# Altium schematic sheet Sheet2.SchDoc
size A3
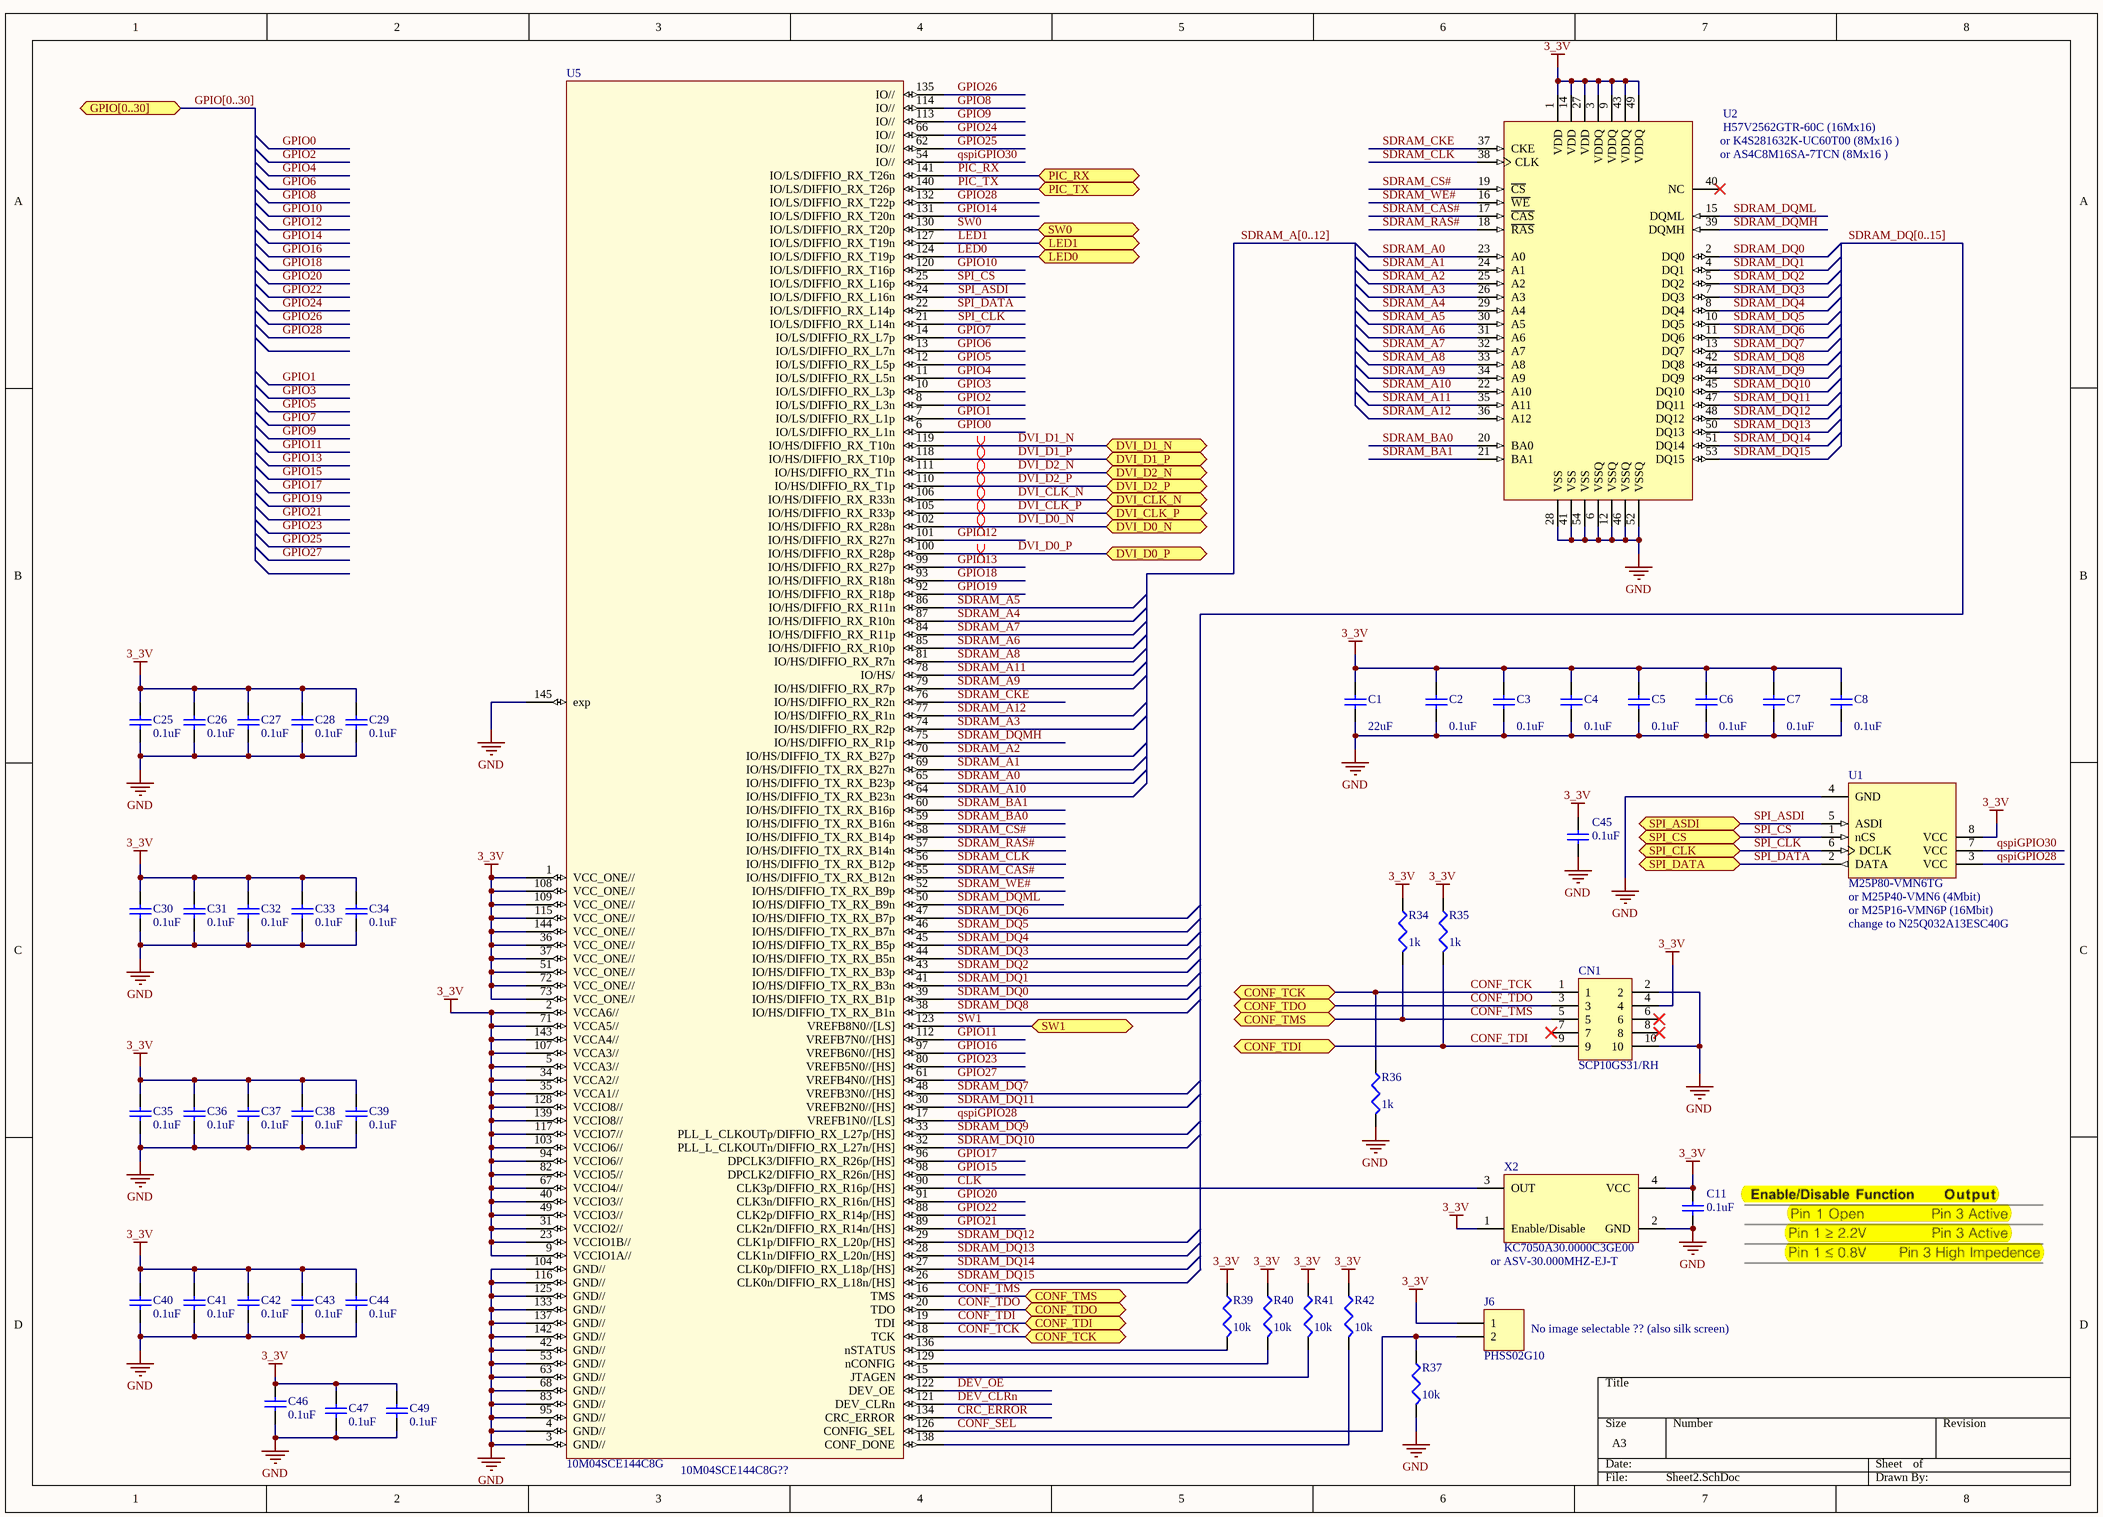
[diagram p0: Sheet2.SchDoc]

## Parts
C1  value 22uF  [CHIP3216]  (hidden comment: MC1206F226Z100CT)
C2  value 0.1uF  [CHIP1608]  (hidden comment: MC0603B104M160CT)
C3  value 0.1uF  [CHIP1608]  (hidden comment: MC0603B104M160CT)
C4  value 0.1uF  [CHIP1608]  (hidden comment: MC0603B104M160CT)
C5  value 0.1uF  [CHIP1608]  (hidden comment: MC0603B104M160CT)
C6  value 0.1uF  [CHIP1608]  (hidden comment: MC0603B104M160CT)
C7  value 0.1uF  [CHIP1608]  (hidden comment: MC0603B104M160CT)
C8  value 0.1uF  [CHIP1608]  (hidden comment: MC0603B104M160CT)
C11  value 0.1uF  [CHIP1608]  (hidden comment: MC0603B104M160CT)
C25  value 0.1uF  [CHIP1608]  (hidden comment: MC0603B104M160CT)
C26  value 0.1uF  [CHIP1608]  (hidden comment: MC0603B104M160CT)
C27  value 0.1uF  [CHIP1608]  (hidden comment: MC0603B104M160CT)
C28  value 0.1uF  [CHIP1608]  (hidden comment: MC0603B104M160CT)
C29  value 0.1uF  [CHIP1608]  (hidden comment: MC0603B104M160CT)
C30  value 0.1uF  [CHIP1608]  (hidden comment: MC0603B104M160CT)
C31  value 0.1uF  [CHIP1608]  (hidden comment: MC0603B104M160CT)
C32  value 0.1uF  [CHIP1608]  (hidden comment: MC0603B104M160CT)
C33  value 0.1uF  [CHIP1608]  (hidden comment: MC0603B104M160CT)
C34  value 0.1uF  [CHIP1608]  (hidden comment: MC0603B104M160CT)
C35  value 0.1uF  [CHIP1608]  (hidden comment: MC0603B104M160CT)
C36  value 0.1uF  [CHIP1608]  (hidden comment: MC0603B104M160CT)
C37  value 0.1uF  [CHIP1608]  (hidden comment: MC0603B104M160CT)
C38  value 0.1uF  [CHIP1608]  (hidden comment: MC0603B104M160CT)
C39  value 0.1uF  [CHIP1608]  (hidden comment: MC0603B104M160CT)
C40  value 0.1uF  [CHIP1608]  (hidden comment: MC0603B104M160CT)
C41  value 0.1uF  [CHIP1608]  (hidden comment: MC0603B104M160CT)
C42  value 0.1uF  [CHIP1608]  (hidden comment: MC0603B104M160CT)
C43  value 0.1uF  [CHIP1608]  (hidden comment: MC0603B104M160CT)
C44  value 0.1uF  [CHIP1608]  (hidden comment: MC0603B104M160CT)
C45  value 0.1uF  [CHIP1608]  (hidden comment: MC0603B104M160CT)
C46  value 0.1uF  [CHIP1608]  (hidden comment: MC0603B104M160CT)
C47  value 0.1uF  [CHIP1608]  (hidden comment: MC0603B104M160CT)
C49  value 0.1uF  [CHIP1608]  (hidden comment: MC0603B104M160CT)
CN1  SCP10GS31/RH  [SCP10GS31/RH]
J6  PHSS02G10  [HDR1X2]
R34  value 1k  [CHIP1608]  (hidden comment: MCMR06X1001FTL)
R35  value 1k  [CHIP1608]  (hidden comment: MCMR06X1001FTL)
R36  value 1k  [CHIP1608]  (hidden comment: MCMR06X1001FTL)
R37  value 10k  [CHIP1608]  (hidden comment: MCWR06X1002FTL)
R39  value 10k  [CHIP1608]  (hidden comment: MCWR06X1002FTL)
R40  value 10k  [CHIP1608]  (hidden comment: MCWR06X1002FTL)
R41  value 10k  [CHIP1608]  (hidden comment: MCWR06X1002FTL)
R42  value 10k  [CHIP1608]  (hidden comment: MCWR06X1002FTL)
U1  M25P80-VMN6TG  [SOIC8_L]
U2  H57V2562GTR-60C (16Mx16)  [TSOP2-54_M]
U5  10M04SCE144C8G  [TEST2]
X2  KC7050A30.0000C3GE00  [CWX823-50.0M]

## Ports
CONF_TCK, CONF_TDI, CONF_TDO, CONF_TMS, DVI_CLK_N, DVI_CLK_P, DVI_D0_N, DVI_D0_P, DVI_D1_N, DVI_D1_P, DVI_D2_N, DVI_D2_P, GPIO[0..30], LED0, LED1, PIC_RX, PIC_TX, SPI_ASDI, SPI_CLK, SPI_CS, SPI_DATA, SW0, SW1

## Nets
3_3V: C1.2 C2.2 C3.2 C4.2 C5.2 C6.2 C7.2 C8.2 C11.2 C25.1 C26.1 C27.1 C28.1 C29.1 C30.1 C31.1 C32.1 C33.1 C34.1 C35.1 C36.1 C37.1 C38.1 C39.1 C40.1 C41.1 C42.1 C43.1 C44.1 C45.2 C46.1 C47.1 C49.1 CN1.4 J6.1 R34.1 R35.1 R39.1 R40.1 R41.1 R42.1 U1.8(VCC) U2.1(VDD) U2.3(VDDQ) U2.9(VDDQ) U2.14(VDD) U2.27(VDD) U2.43(VDDQ) U2.49(VDDQ) U5.1(VCC_ONE//) U5.2(VCCA6//) U5.5(VCCA3//) U5.9(VCCIO1A//) U5.23(VCCIO1B//) U5.31(VCCIO2//) U5.34(VCCA2//) U5.35(VCCA1//) U5.36(VCC_ONE//) U5.37(VCC_ONE//) U5.40(VCCIO3//) U5.49(VCCIO3//) U5.51(VCC_ONE//) U5.67(VCCIO4//) U5.71(VCCA5//) U5.72(VCC_ONE//) U5.73(VCC_ONE//) U5.82(VCCIO5//) U5.94(VCCIO6//) U5.103(VCCIO6//) U5.107(VCCA3//) U5.108(VCC_ONE//) U5.109(VCC_ONE//) U5.115(VCC_ONE//) U5.117(VCCIO7//) U5.128(VCCIO8//) U5.139(VCCIO8//) U5.143(VCCA4//) U5.144(VCC_ONE//) X2.1(Enable/Disable) X2.4(VCC)
GND: C1.1 C2.1 C3.1 C4.1 C5.1 C6.1 C7.1 C8.1 C11.1 C25.2 C26.2 C27.2 C28.2 C29.2 C30.2 C31.2 C32.2 C33.2 C34.2 C35.2 C36.2 C37.2 C38.2 C39.2 C40.2 C41.2 C42.2 C43.2 C44.2 C45.1 C46.2 C47.2 C49.2 CN1.2 CN1.10 R36.2 R37.2 U1.4(GND) U2.6(VSSQ) U2.12(VSSQ) U2.28(VSS) U2.41(VSS) U2.46(VSSQ) U2.52(VSSQ) U2.54(VSS) U5.3(GND//) U5.4(GND//) U5.42(GND//) U5.53(GND//) U5.63(GND//) U5.68(GND//) U5.83(GND//) U5.95(GND//) U5.104(GND//) U5.116(GND//) U5.125(GND//) U5.133(GND//) U5.137(GND//) U5.142(GND//) U5.145(exp) X2.2(GND)
CLK: U5.90(CLK3p/DIFFIO_RX_R16p/[HS]) X2.3(OUT)
CONF_SEL: J6.2 R37.1 U5.126(CONFIG_SEL)
CONF_TCK: CN1.1 R36.1 U5.18(TCK) ; port CONF_TCK
CONF_TDI: CN1.9 R35.2 U5.19(TDI) ; port CONF_TDI
CONF_TDO: CN1.3 U5.20(TDO) ; port CONF_TDO
CONF_TMS: CN1.5 R34.2 U5.16(TMS) ; port CONF_TMS
CRC_ERROR: U5.134(CRC_ERROR)
DEV_CLRn: U5.121(DEV_CLRn)
DEV_OE: U5.122(DEV_OE)
DVI_CLK_N: U5.106(IO/HS/DIFFIO_RX_R33n) ; port DVI_CLK_N
DVI_CLK_P: U5.105(IO/HS/DIFFIO_RX_R33p) ; port DVI_CLK_P
DVI_D0_N: U5.102(IO/HS/DIFFIO_RX_R28n) ; port DVI_D0_N
DVI_D0_P: U5.100(IO/HS/DIFFIO_RX_R28p) ; port DVI_D0_P
DVI_D1_N: U5.119(IO/HS/DIFFIO_RX_T10n) ; port DVI_D1_N
DVI_D1_P: U5.118(IO/HS/DIFFIO_RX_T10p) ; port DVI_D1_P
DVI_D2_N: U5.111(IO/HS/DIFFIO_RX_T1n) ; port DVI_D2_N
DVI_D2_P: U5.110(IO/HS/DIFFIO_RX_T1p) ; port DVI_D2_P
GPIO0: U5.6(IO/LS/DIFFIO_RX_L1n)
GPIO1: U5.7(IO/LS/DIFFIO_RX_L1p)
GPIO2: U5.8(IO/LS/DIFFIO_RX_L3n)
GPIO3: U5.10(IO/LS/DIFFIO_RX_L3p)
GPIO4: U5.11(IO/LS/DIFFIO_RX_L5n)
GPIO5: U5.12(IO/LS/DIFFIO_RX_L5p)
GPIO6: U5.13(IO/LS/DIFFIO_RX_L7n)
GPIO7: U5.14(IO/LS/DIFFIO_RX_L7p)
GPIO8: U5.114(IO//)
GPIO9: U5.113(IO//)
GPIO10: U5.120(IO/LS/DIFFIO_RX_T16p)
GPIO11: U5.112(VREFB7N0//[HS])
GPIO12: U5.101(IO/HS/DIFFIO_RX_R27n)
GPIO13: U5.99(IO/HS/DIFFIO_RX_R27p)
GPIO14: U5.131(IO/LS/DIFFIO_RX_T20n)
GPIO15: U5.98(DPCLK2/DIFFIO_RX_R26n/[HS])
GPIO16: U5.97(VREFB6N0//[HS])
GPIO17: U5.96(DPCLK3/DIFFIO_RX_R26p/[HS])
GPIO18: U5.93(IO/HS/DIFFIO_RX_R18n)
GPIO19: U5.92(IO/HS/DIFFIO_RX_R18p)
GPIO20: U5.91(CLK3n/DIFFIO_RX_R16n/[HS])
GPIO21: U5.89(CLK2n/DIFFIO_RX_R14n/[HS])
GPIO22: U5.88(CLK2p/DIFFIO_RX_R14p/[HS])
GPIO23: U5.80(VREFB5N0//[HS])
GPIO24: U5.66(IO//)
GPIO25: U5.62(IO//)
GPIO26: U5.135(IO//)
GPIO27: U5.61(VREFB4N0//[HS])
GPIO28: U5.132(IO/LS/DIFFIO_RX_T22p)
LED0: U5.124(IO/LS/DIFFIO_RX_T19p) ; port LED0
LED1: U5.127(IO/LS/DIFFIO_RX_T19n) ; port LED1
PIC_RX: U5.141(IO/LS/DIFFIO_RX_T26n) ; port PIC_RX
PIC_TX: U5.140(IO/LS/DIFFIO_RX_T26p) ; port PIC_TX
qspiGPIO28: U1.3(VCC) U5.17(VREFB1N0//[LS])
qspiGPIO30: U1.7(VCC) U5.54(IO//)
SDRAM_A0: U2.23(A0) U5.65(IO/HS/DIFFIO_TX_RX_B23p)
SDRAM_A1: U2.24(A1) U5.69(IO/HS/DIFFIO_TX_RX_B27n)
SDRAM_A2: U2.25(A2) U5.70(IO/HS/DIFFIO_TX_RX_B27p)
SDRAM_A3: U2.26(A3) U5.74(IO/HS/DIFFIO_RX_R2p)
SDRAM_A4: U2.29(A4) U5.87(IO/HS/DIFFIO_RX_R10n)
SDRAM_A5: U2.30(A5) U5.86(IO/HS/DIFFIO_RX_R11n)
SDRAM_A6: U2.31(A6) U5.85(IO/HS/DIFFIO_RX_R10p)
SDRAM_A7: U2.32(A7) U5.84(IO/HS/DIFFIO_RX_R11p)
SDRAM_A8: U2.33(A8) U5.81(IO/HS/DIFFIO_RX_R7n)
SDRAM_A9: U2.34(A9) U5.79(IO/HS/DIFFIO_RX_R7p)
SDRAM_A10: U2.22(A10) U5.64(IO/HS/DIFFIO_TX_RX_B23n)
SDRAM_A11: U2.35(A11) U5.78(IO/HS/)
SDRAM_A12: U2.36(A12) U5.77(IO/HS/DIFFIO_RX_R1n)
SDRAM_BA0: U2.20(BA0) U5.59(IO/HS/DIFFIO_TX_RX_B16n)
SDRAM_BA1: U2.21(BA1) U5.60(IO/HS/DIFFIO_TX_RX_B16p)
SDRAM_CAS#: U2.17(~{CAS}) U5.55(IO/HS/DIFFIO_TX_RX_B12n)
SDRAM_CKE: U2.37(CKE) U5.76(IO/HS/DIFFIO_RX_R2n)
SDRAM_CLK: U2.38(CLK) U5.56(IO/HS/DIFFIO_TX_RX_B12p)
SDRAM_CS#: U2.19(~{CS}) U5.58(IO/HS/DIFFIO_TX_RX_B14p)
SDRAM_DQ0: U2.2(DQ0) U5.39(IO/HS/DIFFIO_TX_RX_B1p)
SDRAM_DQ1: U2.4(DQ1) U5.41(IO/HS/DIFFIO_TX_RX_B3n)
SDRAM_DQ2: U2.5(DQ2) U5.43(IO/HS/DIFFIO_TX_RX_B3p)
SDRAM_DQ3: U2.7(DQ3) U5.44(IO/HS/DIFFIO_TX_RX_B5n)
SDRAM_DQ4: U2.8(DQ4) U5.45(IO/HS/DIFFIO_TX_RX_B5p)
SDRAM_DQ5: U2.10(DQ5) U5.46(IO/HS/DIFFIO_TX_RX_B7n)
SDRAM_DQ6: U2.11(DQ6) U5.47(IO/HS/DIFFIO_TX_RX_B7p)
SDRAM_DQ7: U2.13(DQ7) U5.48(VREFB3N0//[HS])
SDRAM_DQ8: U2.42(DQ8) U5.38(IO/HS/DIFFIO_TX_RX_B1n)
SDRAM_DQ9: U2.44(DQ9) U5.33(PLL_L_CLKOUTp/DIFFIO_RX_L27p/[HS])
SDRAM_DQ10: U2.45(DQ10) U5.32(PLL_L_CLKOUTn/DIFFIO_RX_L27n/[HS])
SDRAM_DQ11: U2.47(DQ11) U5.30(VREFB2N0//[HS])
SDRAM_DQ12: U2.48(DQ12) U5.29(CLK1p/DIFFIO_RX_L20p/[HS])
SDRAM_DQ13: U2.50(DQ13) U5.28(CLK1n/DIFFIO_RX_L20n/[HS])
SDRAM_DQ14: U2.51(DQ14) U5.27(CLK0p/DIFFIO_RX_L18p/[HS])
SDRAM_DQ15: U2.53(DQ15) U5.26(CLK0n/DIFFIO_RX_L18n/[HS])
SDRAM_DQMH: U2.39(DQMH) U5.75(IO/HS/DIFFIO_RX_R1p)
SDRAM_DQML: U2.15(DQML) U5.50(IO/HS/DIFFIO_TX_RX_B9n)
SDRAM_RAS#: U2.18(~{RAS}) U5.57(IO/HS/DIFFIO_TX_RX_B14n)
SDRAM_WE#: U2.16(~{WE}) U5.52(IO/HS/DIFFIO_TX_RX_B9p)
SPI_ASDI: U1.5(ASDI) U5.24(IO/LS/DIFFIO_RX_L16n) ; port SPI_ASDI
SPI_CLK: U1.6(DCLK) U5.21(IO/LS/DIFFIO_RX_L14n) ; port SPI_CLK
SPI_CS: U1.1(nCS) U5.25(IO/LS/DIFFIO_RX_L16p) ; port SPI_CS
SPI_DATA: U1.2(DATA) U5.22(IO/LS/DIFFIO_RX_L14p) ; port SPI_DATA
SW0: U5.130(IO/LS/DIFFIO_RX_T20p) ; port SW0
SW1: U5.123(VREFB8N0//[LS]) ; port SW1
NetR39_2: R39.2 U5.136(nSTATUS)
NetR40_2: R40.2 U5.129(nCONFIG)
NetR41_2: R41.2 U5.15(JTAGEN)
NetR42_2: R42.2 U5.138(CONF_DONE)

Not connected (* = marked no-connect by the designer): CN1 6* 7* 8*; U2 40(NC)*

## Buses and harness runs
bus GPIO[0..30] = port GPIO[0..30]
bus SDRAM_A[0..12]
bus SDRAM_DQ[0..15]

## Layout directives
differential pair: DVI_CLK_N, DVI_CLK_P, DVI_D0_N, DVI_D0_P, DVI_D1_N, DVI_D1_P, DVI_D2_N, DVI_D2_P

## Notes on the sheet
- (near U2) or K4S281632K-UC60T00 (8Mx16 )
- (near U2) or AS4C8M16SA-7TCN (8Mx16 )
- (near U1) or M25P40-VMN6 (4Mbit)
- (near U1) or M25P16-VMN6P (16Mbit)
- change to N25Q032A13ESC40G
- (near X2) or ASV-30.000MHZ-EJ-T
- (near J6) No image selectable ?? (also silk screen)
- (near U5) 10M04SCE144C8G??

## Library data of the parts
C1 = Cap Semi: Capacitor (Semiconductor SIM Model); Vendor: element14(GTI); Published: 8-Jun-2000; LatestRevisionDate: 17-Jul-2002; LatestRevisionNote: Re-released for DXP Platform.; PackageReference: C1206; Publisher: Altium Limited; part2: CC1206KKX5R8BB226
C2-C8 C11 C25-C47 C49 = Cap Semi: Capacitor (Semiconductor SIM Model); Published: 8-Jun-2000; LatestRevisionDate: 17-Jul-2002; LatestRevisionNote: Re-released for DXP Platform.; PackageReference: C1206; Publisher: Altium Limited; part2: CC0603KRX7R9BB104
CN1 = SCP10GS31/RH: GTK; Vendor: ES
J6 = Header 2: Header, 2-Pin; Vendor: ES; LatestRevisionDate: 17-Jul-2002; LatestRevisionNote: Re-released for DXP Platform.; Publisher: Altium Limited
R34-R37 R39-R42 = Res3: Resistor; Published: 8-Jun-2000; LatestRevisionDate: 04-Mar-2005; LatestRevisionNote: PCB Footprint replaced.; PackageReference: J1-0603; Publisher: Altium Limited
  R34-R36: part2: RC0603JR-071KL
  R37 R39-R42: part2: RC0603JR-0710KL
U1 = EPCS1SI8: ALTERA EPCS1 Series, In-system programmable 3.3V serial configuration device, 8-Pin SOIC, 1-Megabit, Industrial Grade; Configures: Cyclone II, Stratix II, & Cyclone Devices; Vendor: ES or RS; Published: 17-Sep-2003; LatestRevisionDate: 13-Apr-2006; LatestRevisionNote: IPC-7351 Footprint Added.; DatasheetVersion: ver2.0, Oct-2003; PackageVersion: ver13.0, May-2005; PackageReference: SOIC8; Publisher: Altium Limited; PackageDescription: 8-Pin Small Outline Integrated Circuit Package (SOIC8); Code_JEDEC: MS-012-AA; Code_IPC: SOIC127P600-8; ComponentLink1Description: Manufacturer Link; ComponentLink1URL: http://www.altera.com/products/devices/config/cfg-index.html; ComponentLink2Description: Configuration Handbook; ComponentLink2URL: http://www.altera.com/literature/hb/cfg/config_handbook.pdf; ComponentLink3Description: Pinout Specification; ComponentLink3URL: http://www.altera.com/literature/hb/cfg/cyc_c51014.pdf; ComponentLink4Description: Packaging Specification; ComponentLink4URL: http://www.altera.com/literature/ds/dspkg.pdf; part2: N25Q032A13ESC40G
U2 = MT48LC16M16A2TG-75: MICRON; CycleTime: 7.5ns @ CL = 3 (PC133); RowAddress: 8K (A0-A12); ColumnAddress: 512 (A0-A8); Vendor: ES; Published: 11-Oct-2004; LatestRevisionDate: 13-Apr-2006; LatestRevisionNote: IPC-7351 Footprint Added.; DatasheetVersion: rev.G, Sep-2003; PackageVersion: Sep-2003; PackageReference: TSOP2-54; Publisher: Altium Limited; PackageDescription: 54-Pin Plastic Small Outline Package 0.8 mm Pitch; Code_JEDEC: MS-024-FA; ComponentLink1Description: Manufacturer Link; ComponentLink1URL: http://www.micron.com; ComponentLink2Description: Datasheet; ComponentLink2URL: http://download.micron.com/pdf/datasheets/dram/sdram/256MSDRAM.pdf; part2: AS4C8M16SA-7TCN
U5 = MAX10: Vendor: Mouser; part2: 10M04SCE144C8G
X2 = CWX823-50.0M: CONNOR-WINFIELD; Vendor: ES; part2: ASV-30.000MHZ-EJ-T